# EasyEDA schematic SCH_BuisnessCard_2024-07-13.json
TITLE: Sheet_1; REV: 1.0; Date: 2024-07-06; Sheet: 1/1; Drawn By: rishabhmathukia; Company: Your Company
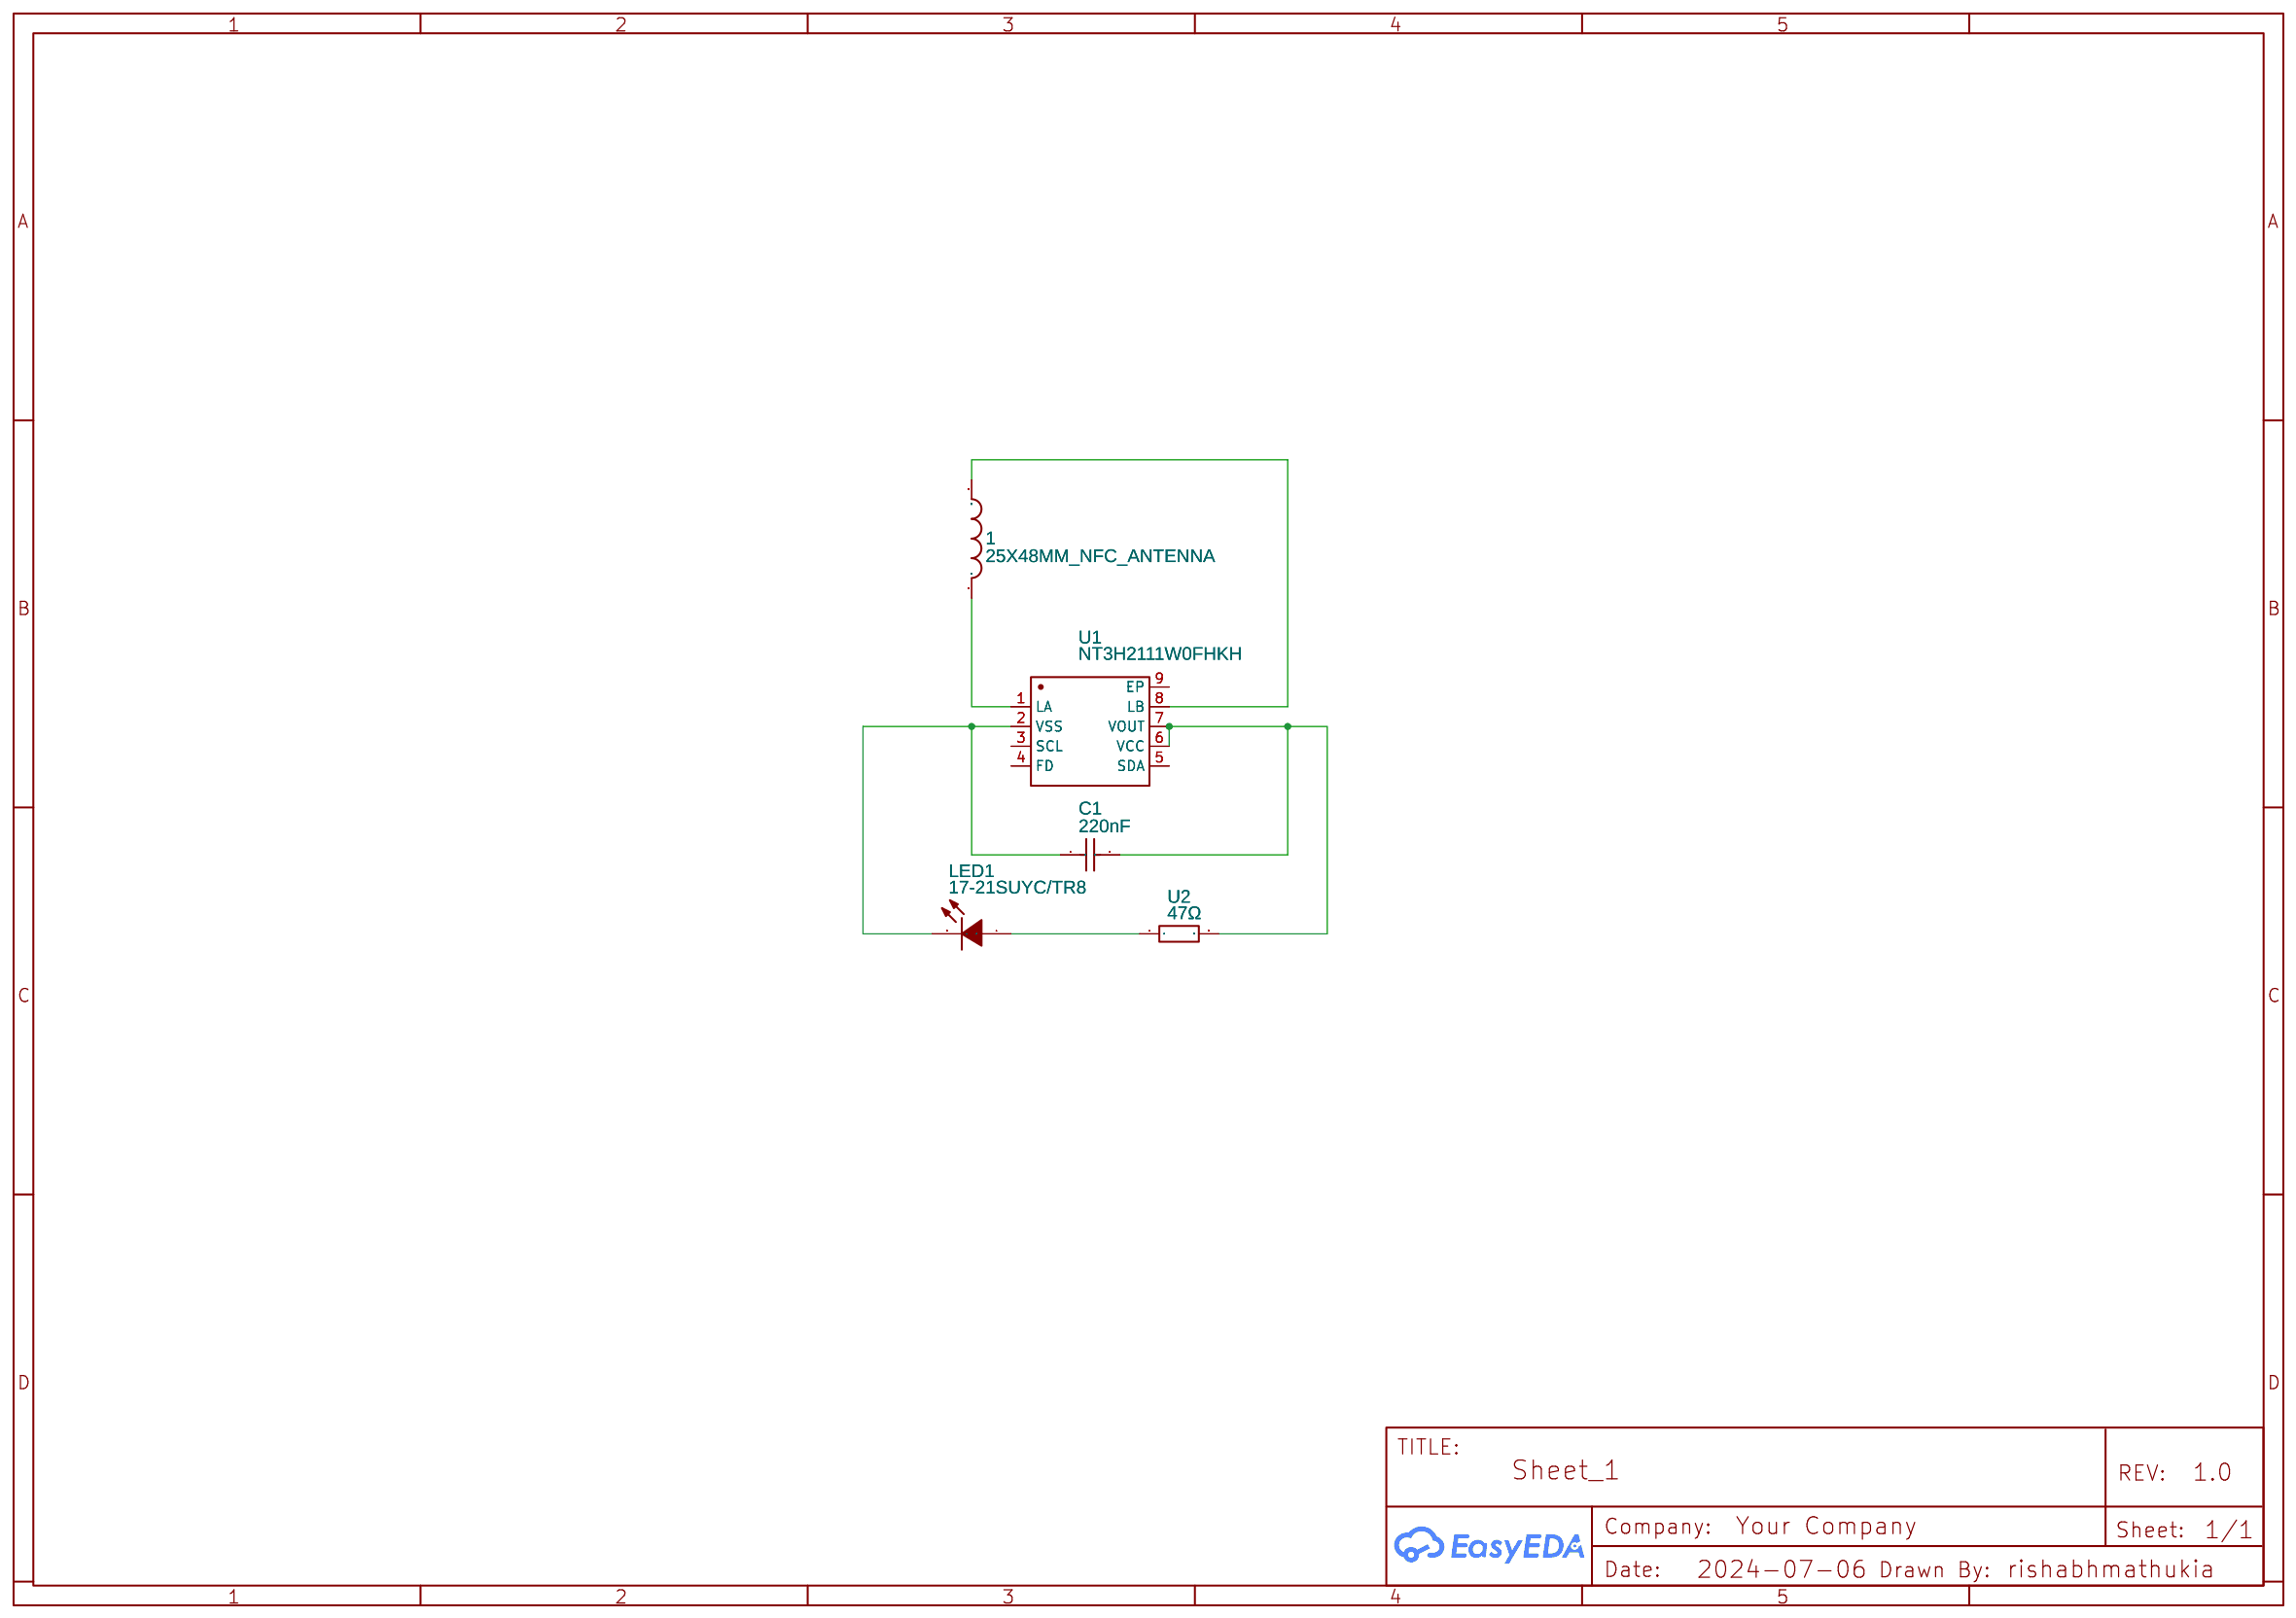
[diagram p0: schematic sheet]

## Parts
1  25X48MM_NFC_ANTENNA  [25X48MM_NFC_ANTENNA]
C1  220nF  [C0402]
LED1  17-21SUYC/TR8  [LED0805-R-RD]
U1  NT3H2111W0FHKH  [XQFN-8_L1.6-W1.6-P0.50-BL]
U2  47Ω  [RES-TH_BD5.0-L15.5-P19.50-D0.7]

## Library data of the parts
1 = 25X48MM_NFC_ANTENNA: Contributor: Shivam Dehinwal
C1 = C1005X5R0J224KT000F: Supplier: LCSC; Manufacturer: TDK; Supplier Part: C76593; JLCPCB Part Class: Extended Part
LED1 = 17-21SUYC/TR8: Supplier: LCSC; Manufacturer: KENTO; Manufacturer Part: KT-0805黄灯; Supplier Part: C2296; JLCPCB Part Class: Basic Part
U1 = NT3H2111W0FHKH: Contributor: LCSC; Supplier: LCSC; Supplier Part: C710403; Manufacturer: NXP(恩智浦); JLCPCB Part Class: Extended Part
U2 = MOF3WS-47Ω±5% T: Contributor: LCSC; Supplier: LCSC; Manufacturer: CCO(千志电子); Supplier Part: C121800; JLCPCB Part Class: Extended Part

## Nets
Net-(1-P$1): 1.P$1 U1.8(LB)
Net-(1-P$2): 1.P$2 U1.1(LA)
Net-(C1-1): C1.1 LED1.2(-) U1.2(VSS)
Net-(C1-2): C1.2 U1.6(VCC) U1.7(VOUT) U2.2
Net-(LED1-1): LED1.1(+) U2.1

Not connected (* = marked no-connect by the designer): U1 3(SCL) 4(FD) 5(SDA) 9(EP)
